# EAGLE design controller3 (EAGLE 7.6.0)
CNAME: timebox controller; CREVISION: 1.0; DESIGNER: volzo
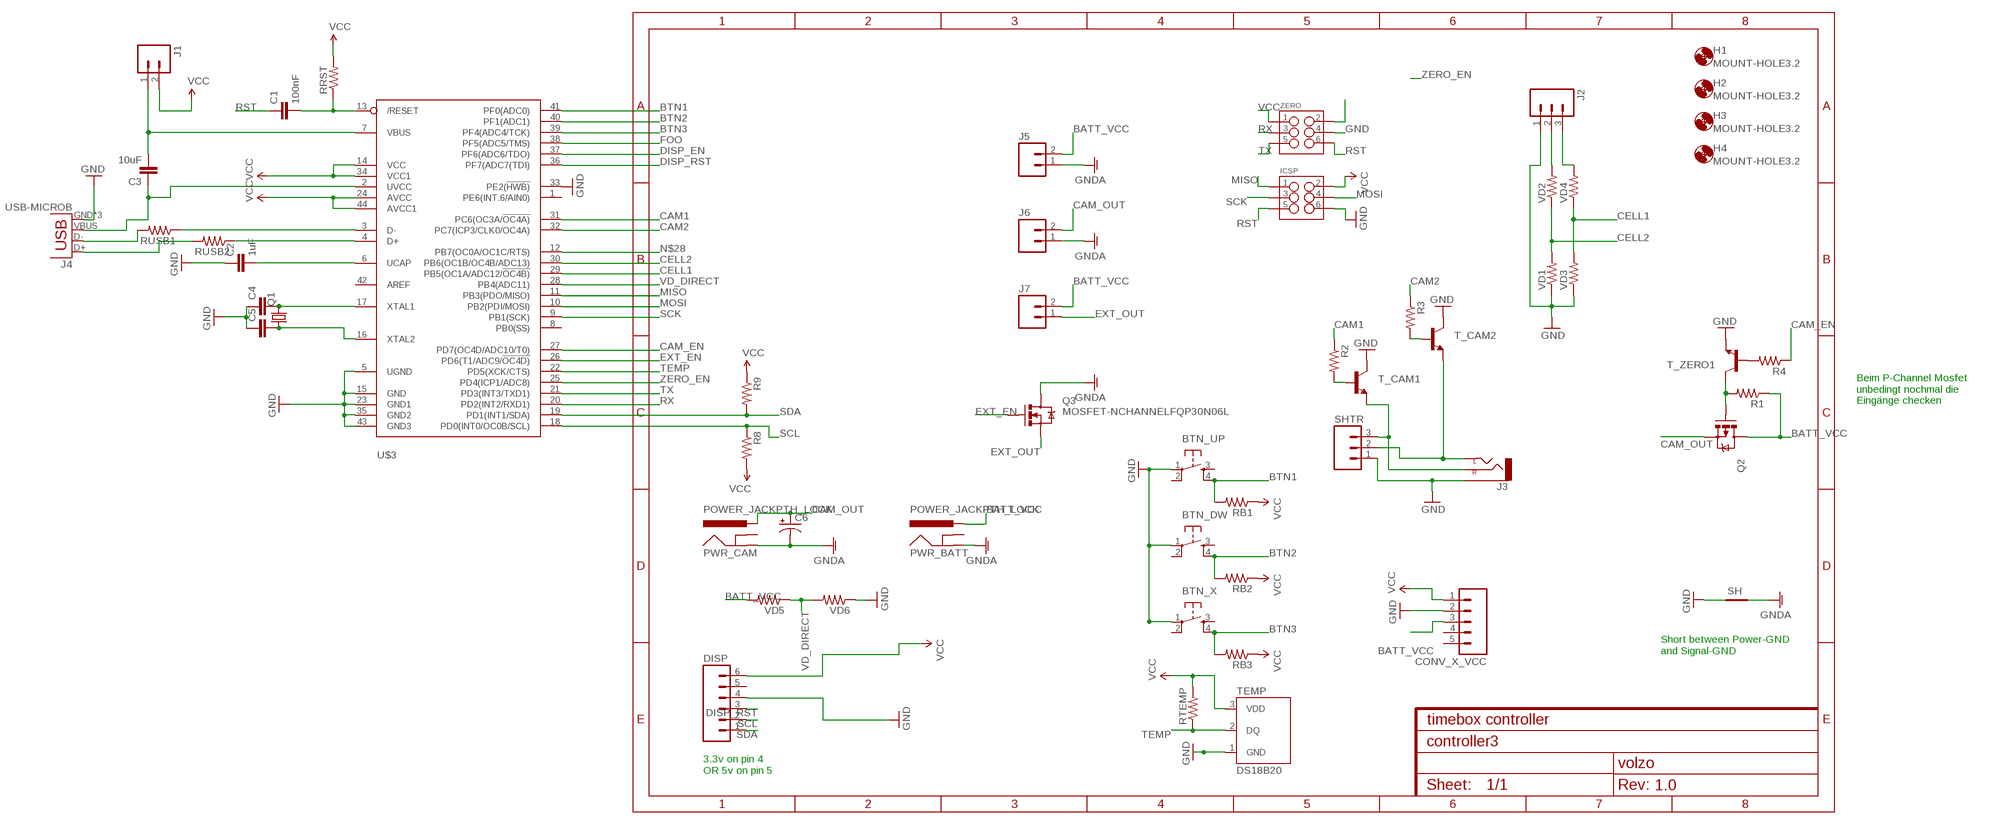
[diagram p0: schematic, sheet 1]

## Parts
BTN_DW  TAC_SWITCHPTH  [TACTILE-PTH]
BTN_UP  TAC_SWITCHPTH  [TACTILE-PTH]
BTN_X  TAC_SWITCHPTH  [TACTILE-PTH]
C1  100nF  CAP1206  [1206]
C2  1uF  CAP1206  [1206]
C3  10uF  CAP1206  [1206]
C4  CAP1206  [1206]
C5  CAP1206  [1206]
C6  CAP_POLPTH3  [CPOL-RADIAL-1000UF-63V]
CONV_X_VCC  M05LOCK  [1X05_LOCK]
DISP  M06FEMALE_LOCK  [1X06_FEMALE_LOCK.010]
H1  MOUNT-HOLE3.2  [3,2]
H2  MOUNT-HOLE3.2  [3,2]
H3  MOUNT-HOLE3.2  [3,2]
H4  MOUNT-HOLE3.2  [3,2]
ICSP  M03X2FEMALE  [2X3]
J1  M02LOCK  [1X02_LOCK]
J2  M03LOCK  [1X03_LOCK]
J3  AUDIO-JACK2.5MM  [STEREOJACK2.5MM_STEREOJACK2.5MM]
J4  USB-MICROB  [USB-MICROB]
J5  M025MM  [SCREWTERMINAL-5MM-2]
J6  M025MM  [SCREWTERMINAL-5MM-2]
J7  M025MM  [SCREWTERMINAL-5MM-2]
PWR_BATT  POWER_JACKPTH_LOCK  [POWER_JACK_PTH_LOCK]
PWR_CAM  POWER_JACKPTH_LOCK  [POWER_JACK_PTH_LOCK]
Q1  CRYSTALHC49S  [HC49/S]
Q2  MOSFET-PCHANNELFQP27P06  [TO220V]
Q3  MOSFET-NCHANNELFQP30N06L  [TO220V]
R1  RESISTOR1206  [1206]
R2  RESISTOR1206  [1206]
R3  RESISTOR1206  [1206]
R4  RESISTOR1206  [1206]
R8  RESISTOR1206  [1206]
R9  RESISTOR1206  [1206]
RB1  RESISTOR1206  [1206]
RB2  RESISTOR1206  [1206]
RB3  RESISTOR1206  [1206]
RRST  RESISTOR1206  [1206]
RTEMP  RESISTOR1206  [1206]
RUSB1  RESISTOR1206  [1206]
RUSB2  RESISTOR1206  [1206]
SH  SHORT-HT5  [SHORT_TOP-50]
SHTR  M03LOCK  [1X03_LOCK]
T_CAM1  TRANSISTOR_NPN2N3904  [TO-92]
T_CAM2  TRANSISTOR_NPN2N3904  [TO-92]
T_ZERO1  TRANSISTOR_NPN2N3904  [TO-92]
TEMP  DS18B20  [TO-92-AMMO]
U$3  ATMEGA32U4-AU  [TQFP44]
VD1  RESISTOR1206  [1206]
VD2  RESISTOR1206  [1206]
VD3  RESISTOR1206  [1206]
VD4  RESISTOR1206  [1206]
VD5  RESISTOR1206  [1206]
VD6  RESISTOR1206  [1206]
ZERO  M03X2FEMALE  [2X3]

## Nets
BATT_VCC [power]: CONV_X_VCC.3 J5.2 J7.2 PWR_BATT.PWR Q2.2(D) R1.1 VD5.2
BTN1: BTN_UP.4 RB1.2 U$3.41(PF0(ADC0))
BTN2: BTN_DW.4 RB2.2 U$3.40(PF1(ADC1))
BTN3: BTN_X.4 RB3.2 U$3.39(PF4(ADC4/TCK))
CAM1: R2.1 U$3.31(PC6(OC3A/!OC4A))
CAM2: R3.1 U$3.32(PC7(ICP3/CLK0/OC4A))
CAM_EN: R4.1 U$3.27(PD7(OC4D/ADC10/T0))
CAM_OUT [power]: C6.1(+) J6.2 PWR_CAM.PWR Q2.3(S)
CELL1: U$3.29(PB5(OC1A/ADC12/!OC4B)) VD3.2 VD4.1
CELL2: U$3.30(PB6(OC1B/OC4B/ADC13)) VD1.2 VD2.1
DISP_EN: U$3.37(PF6(ADC6/TDO))
DISP_RST: DISP.3 U$3.36(PF7(ADC7(TDI))
EXT_EN: Q3.1(G) U$3.26(PD6(T1/ADC9/!OC4D))
EXT_OUT: J7.1 Q3.3(S)
FOO: U$3.38(PF5(ADC5/TMS))
GND: BTN_DW.1 BTN_UP.1 BTN_X.1 C2.1 C4.1 C5.1 CONV_X_VCC.2 DISP.4 ICSP.6 J2.1 J3.SHIELD(SLEEVE) J4.GND J4.MT1(GND) J4.MT2(GND) SH.1 SHTR.1 T_CAM1.3(C) T_CAM2.3(C) T_ZERO1.1(E) TEMP.1(GND) U$3.5(UGND) U$3.15(GND) U$3.23(GND1) U$3.33(PE2(!HWB)) U$3.35(GND2) U$3.43(GND3) VD1.1 VD3.1 VD6.1 ZERO.4
GNDA [power]: C6.2(-) J5.1 J6.1 PWR_BATT.GND PWR_CAM.GND Q3.2(D) SH.2
MISO: ICSP.1 U$3.11(PB3(PDO/MISO))
MOSI: ICSP.4 U$3.10(PB2(PDI/MOSI))
N$1: C1.2 RRST.1 U$3.13(/RESET)
N$2: J2.3 VD4.2
N$3: J2.2 VD2.2
N$4: RUSB1.1 U$3.3(D-)
N$5: RUSB2.1 U$3.4(D+)
N$6: C3.1 J4.VBUS U$3.2(UVCC)
N$7: R4.2 T_ZERO1.2(B)
N$8: C4.2 Q1.2 U$3.17(XTAL1)
N$9: C5.2 Q1.1 U$3.16(XTAL2)
N$10: ZERO.2
N$11: C3.2 J1.1 U$3.7(VBUS)
N$12: J4.D- RUSB1.2
N$13: J4.D+ RUSB2.2
N$16: J3.RING(RIGHT) SHTR.3 T_CAM1.1(E)
N$17: J3.TIP(LEFT) SHTR.2 T_CAM2.1(E)
N$18: R2.2 T_CAM1.2(B)
N$19: R3.2 T_CAM2.2(B)
N$20: C2.2 U$3.6(UCAP)
N$21: Q2.1(G) R1.2 T_ZERO1.3(C)
N$28: U$3.12(PB7(OC0A/OC1C/RTS))
RST: C1.1 ICSP.5 ZERO.6
RX: U$3.20(PD2(INT2/RXD1)) ZERO.3
SCK: ICSP.3 U$3.9(PB1(SCK))
SCL: DISP.2 R8.1 U$3.18(PD0(INT0/OC0B/SCL))
SDA: DISP.1 R9.2 U$3.19(PD1(INT1/SDA))
TEMP: RTEMP.1 TEMP.2(DQ) U$3.22(PD5(XCK/CTS))
TX: U$3.21(PD3(INT3/TXD1)) ZERO.5
VCC: CONV_X_VCC.1 DISP.6 ICSP.2 J1.2 R8.2 R9.1 RB1.1 RB2.1 RB3.1 RRST.2 RTEMP.2 TEMP.3(VDD) U$3.14(VCC) U$3.24(AVCC) U$3.34(VCC1) U$3.44(AVCC1) ZERO.1
VD_DIRECT: U$3.28(PB4(ADC11)) VD5.1 VD6.2
ZERO_EN: U$3.25(PD4(ICP1/ADC8))
Unconnected: BTN_DW.2 BTN_DW.3 BTN_UP.2 BTN_UP.3 BTN_X.2 BTN_X.3 CONV_X_VCC.4 CONV_X_VCC.5 DISP.5 PWR_BATT.GNDBREAK PWR_CAM.GNDBREAK U$3.1(PE6(INT.6/AIN0)) U$3.8(PB0(SS)) U$3.42(AREF)

## Notes on the sheet
- Beim P-Channel Mosfet
  unbedingt nochmal die 
  Eingänge checken
- Short between Power-GND
  and Signal-GND
- 3.3v on pin 4
  OR 5v on pin 5

## Library data of the parts
BTN_DW BTN_UP BTN_X = SparkFun-Retired:TAC_SWITCH: Momentary Switch Button commonly used for reset or general input. Spark Fun Electronics SKU : COM-00097 SMT- SWCH-08247
C1 C3-C5 = SparkFun-Passives:CAP: Capacitor Standard 0603 ceramic capacitor, and 0.1" leaded capacitor.
C2 = SparkFun-Capacitors:CAP: Capacitor Standard 0603 ceramic capacitor, and 0.1" leaded capacitor.
C6 = SparkFun-Capacitors:CAP_POL: Capacitor Polarized These are standard SMD and PTH capacitors. Normally 10uF, 47uF, and 100uF in electrolytic and tantalum varieties. Always verify the external diameter of the through hole cap, it varies with capacity, voltage, and manufacturer. The EIA devices should be standard.
CONV_X_VCC = SparkFun-Connectors:M05: Header 5 Standard 5-pin 0.1" header. Use with straight break away headers (SKU : PRT-00116), right angle break away headers (PRT-00553), swiss pins (PRT-00743), machine pins (PRT-00117), and female headers (PRT-00115). Molex polarized connector foot print use with SKU : PRT-08230 with associated crimp pins and housings.
DISP = SparkFun-Connectors:M06: Header 6 Standard 6-pin 0.1" header. Use with straight break away headers (SKU : PRT-00116), right angle break away headers (PRT-00553), swiss pins (PRT-00743), machine pins (PRT-00117), and female headers (PRT-00115). Molex polarized connector foot print use with SKU : PRT-08094 with associated crimp pins and housings. NOTES ON THE VARIANTS LOCK and LOCK_LONGPADS... This footprint was designed to help hold the alignment of a through-hole component (i.e. 6-pin header) while soldering it into place. You may notice that each hole has been shifted either up or down by 0.005 of an inch from it's more standard position (which is a perfectly straight line). This slight alteration caused the pins (the squares in the middle) to touch the edges of the holes. Because they are alternating, it causes a "brace" to hold the component in place. 0.005 has proven to be the perfect amount of "off-center" position when using our standard breakaway headers. Although looks a little odd when you look at the bare footprint, once you have a header in there, the alteration is very hard to notice. Also,if you push a header all the way into place, it is covered up entirely on the bottom side. This idea of altering the position of holes to aid alignment will be further integrated into the Sparkfun Library for other footprints. It can help hold any component with 3 or more connection pins.
H1-H4 = holes:MOUNT-HOLE: MOUNTING HOLE with drill center marker
ICSP ZERO = SparkFun-Connectors:M03X2: 2x3 .1" header. Shrouded, with keying- CONN-10681 SMT- CONN-11415 Pogo pins- HW-11044; PROD_ID: CONN-11566; VALUE: FEMALE 2x3
J1 = SparkFun-Connectors:M02: Standard 2-pin 0.1" header. Use with - straight break away headers ( PRT-00116) - right angle break away headers (PRT-00553) - swiss pins (PRT-00743) - machine pins (PRT-00117) - female headers (PRT-00115) Molex polarized connector foot print use with: PRT-08233 with associated crimp pins and housings. 2.54_SCREWTERM for use with PRT-10571. 3.5mm Screw Terminal footprints for PRT-08084 5mm Screw Terminal footprints for use with PRT-08432
J2 SHTR = SparkFun-Connectors:M03: Header 3 Standard 3-pin 0.1" header. Use with straight break away headers (SKU : PRT-00116), right angle break away headers (PRT-00553), swiss pins (PRT-00743), machine pins (PRT-00117), and female headers (PRT-00115). Molex polarized connector foot print use with SKU : PRT-08232 with associated crimp pins and housings.
J3 = SparkFun-Connectors:AUDIO-JACK: 3.5mm Audio Jack Simple 3.5mm common PCB mount audio jack. Variant PTH is our storefront SKU PRT-08032
J4 = SparkFun-Connectors:USB: USB Connectors USB-B-PTH is fully proven SKU : PRT-00139/CONN-08278 USB-miniB is fully proven SKU : PRT-00587 USB-A-PCB is untested. USB-A-H is throughly reviewed, but untested. Spark Fun Electronics SKU : PRT-00437 USB-B-SMT is throughly reviewed, but untested. Needs silkscreen touching up. USB-A-S has not been used/tested USB-MB-H has not been used/tested USB-MICROB has been used. CONN-09505; PROD_ID: CONN-09505
J5-J7 = SparkFun-Connectors:M02: Standard 2-pin 0.1" header. Use with - straight break away headers ( PRT-00116) - right angle break away headers (PRT-00553) - swiss pins (PRT-00743) - machine pins (PRT-00117) - female headers (PRT-00115) Molex polarized connector foot print use with: PRT-08233 with associated crimp pins and housings. 2.54_SCREWTERM for use with PRT-10571. 3.5mm Screw Terminal footprints for PRT-08084 5mm Screw Terminal footprints for use with PRT-08432; STOREFRONT_ID: PRT-08432
PWR_BATT PWR_CAM = SparkFun-Connectors:POWER_JACK: Power Jack This is the standard 5.5mm barrel jack for power. The PTH is the most common, proven, reliable, footprint. The Slot footprint only works if the mill layer is transmitted to the PCB fab house so be warned. Mating wall wart : TOL-00298 (and others); PROD_ID: CONN-08197; SF_ID: PRT-00119
Q1 = adafruit:CRYSTAL: CRYSTAL; OC_FARNELL: 1667008; OC_NEWARK: unknown
Q2 = SparkFun-DiscreteSemi:MOSFET-PCHANNEL: Generic PMOSFET IRLML2244 - TRANS-11153 (SOT-23 -20V -4.3A) (1.Gate 2.Source 3.Drain) FQP27P06 - COM-10349 <http://www.sparkfun.com/products/10349> (TO-220 -60V -27A) (1.Gate 2.Source 3.Drain)
Q3 = SparkFun-DiscreteSemi:MOSFET-NCHANNEL: Common NMOSFET Parts MFG P/N Store ID Prod ID FDD8780 TRANS-09984 SI7820DN TRANS-11055 FDS6630A IC-08089 2N7002PW TRANS-11151 FQP30N06L COM-10213 TRANS-10060 BSS123LT1G TRANS-08345 BSS138 TRANS-00830 BS170 2N7000; PROD_ID: TRANS-10060
R1-R4 R8 R9 RB1-RB3 RRST RTEMP RUSB1 RUSB2 VD1-VD6 = SparkFun-Passives:RESISTOR: Resistor Basic schematic elements and footprints for 0603, 1206, and PTH resistors.
SH = shorts-old:SHORT-H: Short between two nets; BOM: no
T_CAM1 T_CAM2 T_ZERO1 = SparkFun-DiscreteSemi:TRANSISTOR_NPN: Generic NPN BJT MMBT2222A - TRANS-08049 (SOT-23, 1A 40V) MPSA42 - TRANS-09116 (SOT-23, 500mA 300V) MMBT5088LT1G - TRANS-11160 (SOT-23, 50 mA 30V) BC547 - COM-08928 <http://www.sparkfun.com/products/8928> (TO-92 45V 100mA) (1.Collector 2.Base 3.Emitter) 2N3904 - COM-00521 <http://www.sparkfun.com/products/521> (TO-92 40V 200mA) (1.Emitter 2.Base 3.Collector) P2N2222A - COM-12852 <http://www.sparkfun.com/products/12852> (TO-92 40V 600mA) (1.Collector 2.Base 3.Emitter); PROD_ID: TRANS-08447
TEMP = SparkFun-Sensors:DS18B20: Dallas/Maxim DS18B20 1-wire temperature sensor Datasheet: http://datasheets.maximintegrated.com/en/ds/DS18B20.pdf temp thermometer 1-wire one-wire one wire; STORE_ID: SEN-00245
U$3 = adafruit:ATMEGA32U4: http://www.ladyada.net/library/eagle

## Net classes
0 default: width 0.508 mm
1 power: width 0.762 mm, clearance 0.254 mm

## Board
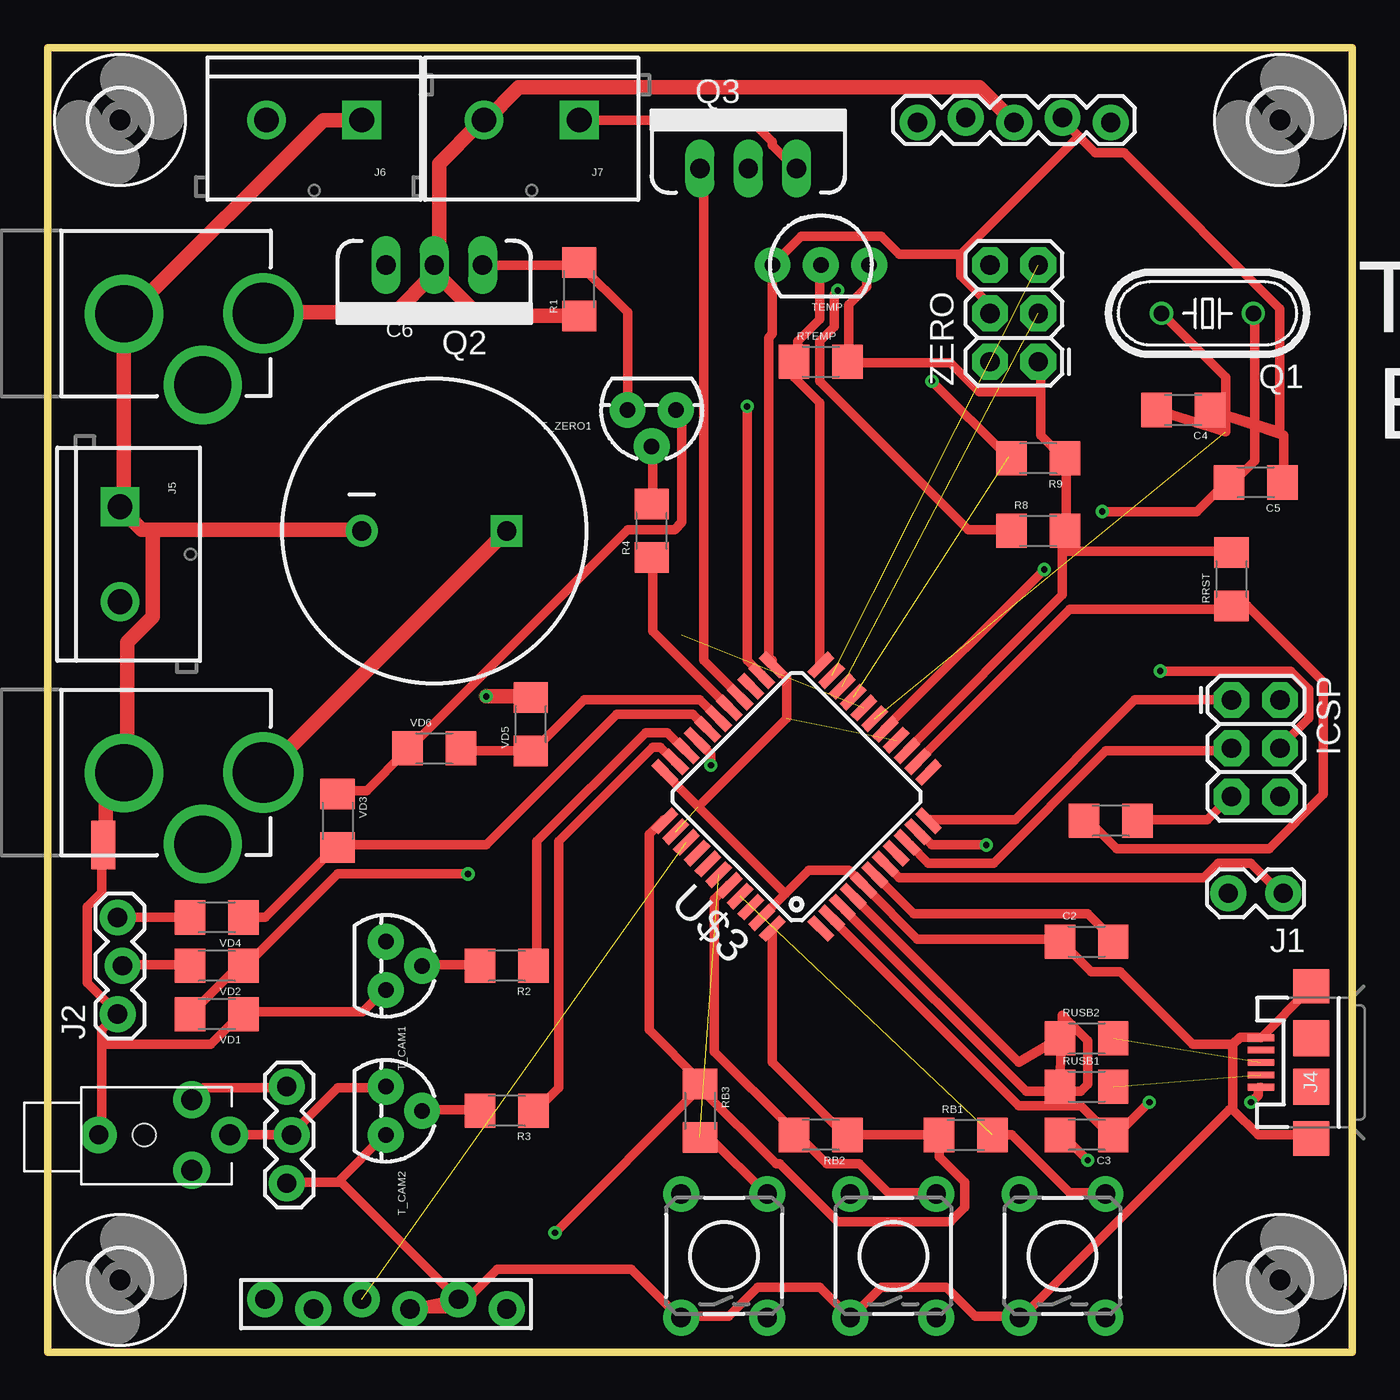
[diagram p1: board, top side]
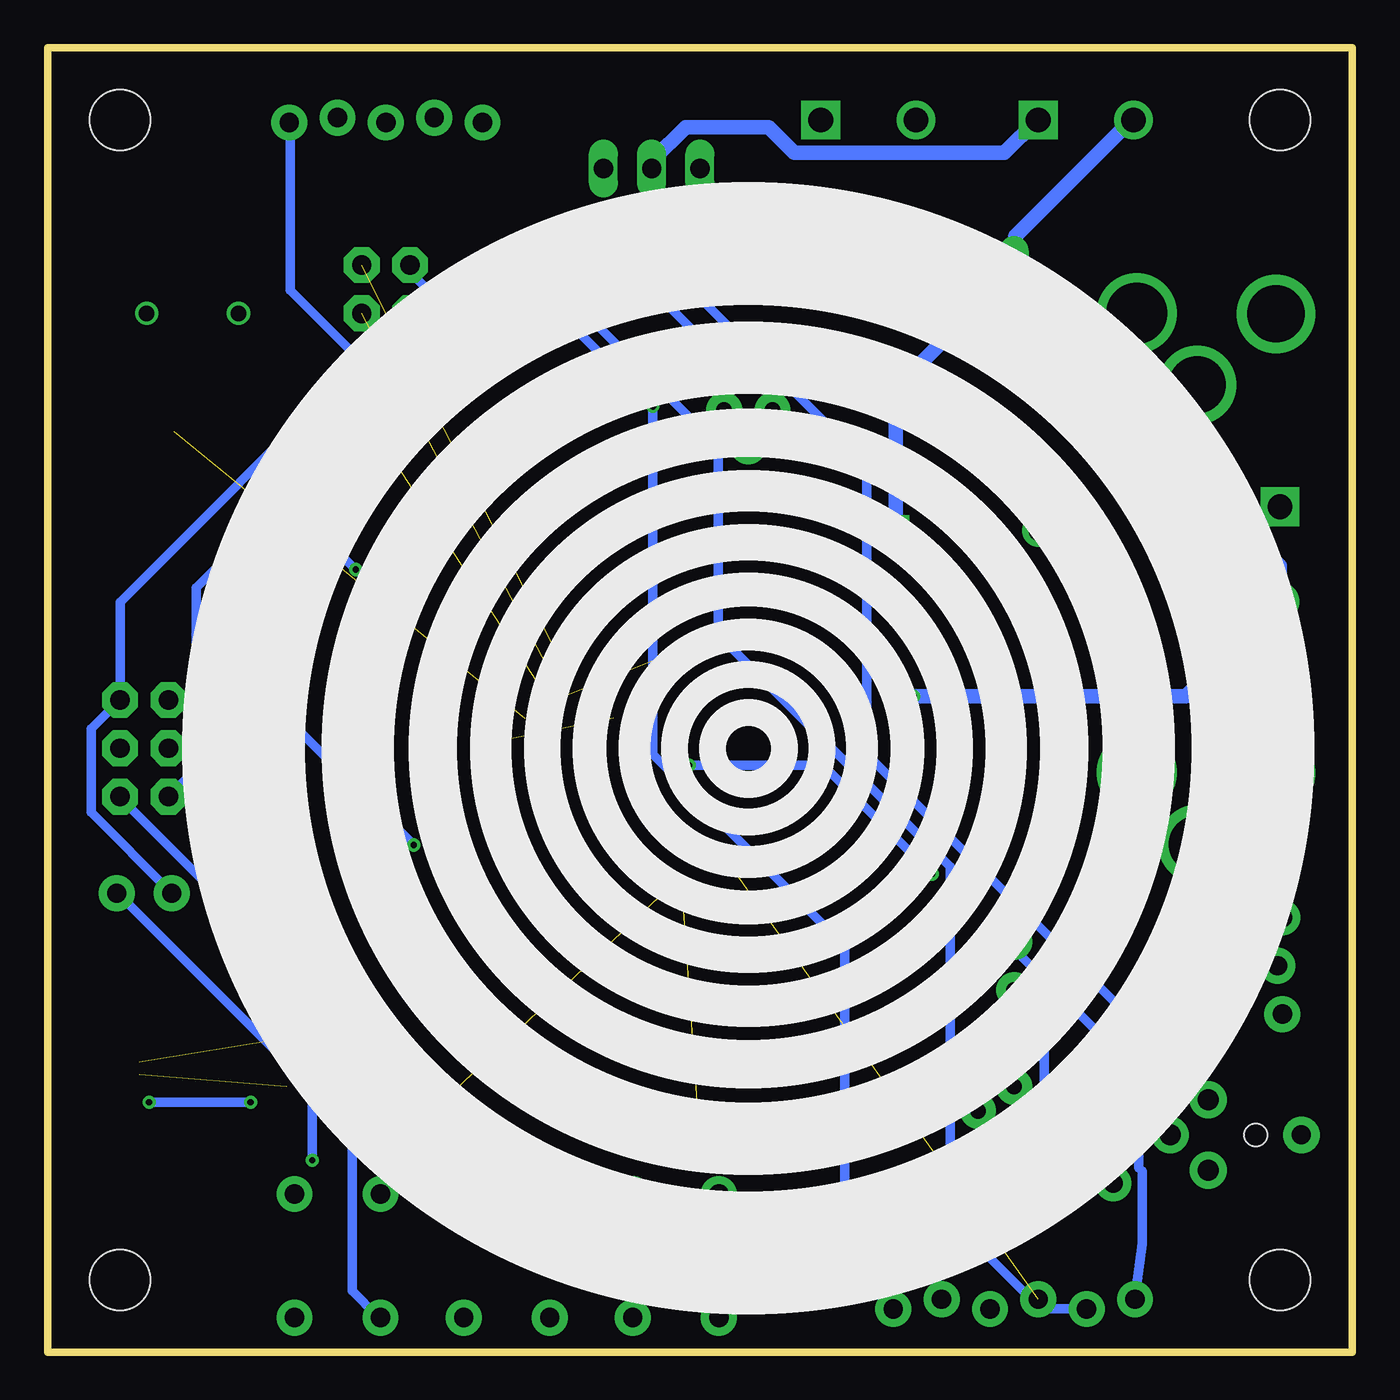
[diagram p2: board, bottom side, seen from below]

Size 68.58 x 68.58 mm. Coordinates in mm from the lower left corner, seen from the top.
Outline: 0,0 68.58,0 68.58,68.58 0,68.58 0,0
Copper layers (1*16): Top 0.0356mm / dielectric 1.5011mm / Bottom 0.0356mm
Design rules "oshpark-2layer *": minimum track width 6mil, minimum drill 13mil, track to track 10mil, track to pad 10mil, pad to pad 10mil, via to via 10mil, smd to smd 10mil, copper to edge 15mil, drill to drill 6mil, minimum pad ring 7mil, minimum via ring 7mil, stop-mask expansion 2.5mil, vias tented up to drill 0mil, thermal gap 10mil

### Footprints (pad centres in the part's own frame; a part is rotated, then mirrored left to right if it is on the bottom)
TACTILE-PTH = drill 1.016 pad 1.88: 1 -3.251,2.261; 2 3.251,2.261; 3 -3.251,-2.261; 4 3.251,-2.261
1206 = smd 1.6 x 1.8: 1 -1.4,0; 2 1.4,0
CPOL-RADIAL-1000UF-63V = drill 1.016 pad 1.651 square: 1 3.81,0 | drill 1.016 pad 1.676: 2 -3.81,0
1X05_LOCK = drill 1.016 pad 1.88: 1 0,0.127; 2 2.54,-0.127; 3 5.08,0.127; 4 7.62,-0.127; 5 10.16,0.127
1X06_FEMALE_LOCK.010 = drill 1.016 pad 1.88: 1 0,0.254; 2 2.54,-0.254; 3 5.08,0.254; 4 7.62,-0.254; 5 10.16,0.254; 6 12.7,-0.254
3,2 = hole 3.2: 0,0
2X3 = drill 1.016 pad 1.88 octagon: 1 0,0; 2 0,2.54; 3 2.54,0; 4 2.54,2.54; 5 5.08,0; 6 5.08,2.54
1X02_LOCK = drill 1.016 pad 1.88: 1 -0.178,0; 2 2.718,0
1X03_LOCK = drill 1.016 pad 1.88: 1 0,0.127; 2 2.54,-0.127; 3 5.08,0.127
STEREOJACK2.5MM_STEREOJACK2.5MM = drill 1.1 pad 1.93: RING 2.5,1.85; RING2 2.5,-1.85; TIP 4.5,0 | drill 1 pad 1.93: SHIELD -2.4,0 | hole 1.2: 0,0
USB-MICROB = smd 0.35 x 1.4: D+ 0,2.65; D- -0.65,2.65; GND 1.3,2.65; ID 0.65,2.65; VBUS -1.3,2.65 | smd 1.8 x 1.9: MT1 -4,0; MT2 4,0 | smd 1.9 x 1.9: P$1 -1.27,0; P$2 1.27,0
SCREWTERMINAL-5MM-2 = drill 1.3 pad 2.032 square: 1 0,0 | drill 1.3 pad 2.032: 2 5,0
POWER_JACK_PTH_LOCK = drill 2.997 pad 4.115: GND 0.025,6.557; GNDBREAK 3.762,10.7 | drill 3.2 pad 4.115: PWR 0,13.878
HC49/S = drill 0.813: 1 -2.413,0; 2 2.413,0
TO220V = drill 1.016 long: 1 -2.54,0; 2 0,0; 3 2.54,0
SHORT_TOP-50 = smd 1.27 x 1.27: 1 0.635,0; 2 -0.635,0
TO-92 = drill 0.813 pad 1.88: 1 -1.27,0; 2 0,1.905; 3 1.27,0
TO-92-AMMO = drill 0.813 pad 1.88: 1 -2.54,0; 2 0,0; 3 2.54,0
TQFP44 = smd 1.5 x 0.5: 1 -5.8,4; 2 -5.8,3.2; 3 -5.8,2.4; 4 -5.8,1.6; 5 -5.8,0.8; 6 -5.8,0; 7 -5.8,-0.8; 8 -5.8,-1.6; 9 -5.8,-2.4; 10 -5.8,-3.2; 11 -5.8,-4; 23 5.8,-4; 24 5.8,-3.2; 25 5.8,-2.4; 26 5.8,-1.6; 27 5.8,-0.8; 28 5.8,0; 29 5.8,0.8; 30 5.8,1.6; 31 5.8,2.4; 32 5.8,3.2; 33 5.8,4 | smd 0.5 x 1.5: 12 -4,-5.8; 13 -3.2,-5.8; 14 -2.4,-5.8; 15 -1.6,-5.8; 16 -0.8,-5.8; 17 0,-5.8; 18 0.8,-5.8; 19 1.6,-5.8; 20 2.4,-5.8; 21 3.2,-5.8; 22 4,-5.8; 34 4,5.8; 35 3.2,5.8; 36 2.4,5.8; 37 1.6,5.8; 38 0.8,5.8; 39 0,5.8; 40 -0.8,5.8; 41 -1.6,5.8; 42 -2.4,5.8; 43 -3.2,5.8; 44 -4,5.8

### Placement (x,y rotation side)
BTN_DW  44.45,5.08 90 top
BTN_UP  53.34,5.08 90 top
BTN_X  35.56,5.08 90 top
C1  55.88,27.94 180 top
C2  54.61,21.59 0 top
C3  54.61,11.43 180 top
C4  59.69,49.53 180 top
C5  63.5,45.72 180 top
C6  20.32,43.18 0 top
CONV_X_VCC  55.88,64.77 180 top
DISP  11.43,2.54 0 top
H1  3.81,64.77 0 top
H2  64.77,3.81 0 top
H3  64.77,64.77 0 top
H4  3.81,3.81 0 top
ICSP  62.23,34.29 270 top
J1  64.77,24.13 180 top
J2  3.81,17.78 90 top
J3  5.08,11.43 0 top
J4  66.42,15.24 90 top
J5  3.81,44.45 270 top
J6  16.51,64.77 180 top
J7  27.94,64.77 180 top
PWR_BATT  -2.54,54.61 270 top
PWR_CAM  -2.54,30.48 270 top
Q1  60.96,54.61 180 top
Q2  20.32,57.15 180 top
Q3  36.83,62.23 0 top
R1  27.94,55.88 90 top
R2  24.13,20.32 180 top
R3  24.13,12.7 180 top
R4  31.75,43.18 90 top
R8  52.07,43.18 0 top
R9  52.07,46.99 180 top
RB1  48.26,11.43 0 top
RB2  40.64,11.43 180 top
RB3  34.29,12.7 270 top
RRST  62.23,40.64 90 top
RTEMP  40.64,52.07 0 top
RUSB1  54.61,13.97 0 top
RUSB2  54.61,16.51 0 top
SH  2.92,26.67 270 top
SHTR  12.7,8.89 90 top
T_CAM1  17.78,20.32 270 top
T_CAM2  17.78,12.7 270 top
T_ZERO1  31.75,49.53 180 top
TEMP  40.64,57.15 0 top
U$3  39.37,29.21 135 top
VD1  8.89,17.78 180 top
VD2  8.89,20.32 180 top
VD3  15.24,27.94 270 top
VD4  8.89,22.86 180 top
VD5  25.4,33.02 90 top
VD6  20.32,31.75 0 top
ZERO  52.07,52.07 90 top

### Tracks (layer width: path | path; a pad name or v marks a point on that pad's centre or on a via)
BATT_VCC  (via drill 0.33)
  Top 0.762: v23.05,34.48 25.34,34.48 VD5.2 | R1.1 27.81,54.48 22.67,54.48 20.38,56.77 20.38,57.15 Q2.2 | CONV_X_VCC.3 48.96,66.48 24.77,66.48 23.05,64.77 J7.2 22.67,64.58 20.57,62.48 20.57,57.34 Q2.2 | PWR_BATT.PWR 11.43,54.67 18.29,54.67 20.19,56.58 Q2.2
  Bottom 0.762: v23.05,34.48 8.76,34.48 3.81,39.43 J5.2 3.81,41.34 11.24,48.77 11.24,54.48 PWR_BATT.PWR
BTN1  (1 unrouted)
  Top 0.508: RB1.2 50.67,11.43 53.72,8.38 55.44,8.38 BTN_UP.4
BTN2
  Top 0.508: U$3.40 35.81,24.57 35.05,23.81 35.05,15.81 39.05,11.81 39.05,11.43 RB2.2 39.43,11.43 40.96,9.91 42.67,9.91 44.2,8.38 46.67,8.38 BTN_DW.4
BTN3  (1 unrouted)
  Top 0.508: RB3.2 34.29,11.24 34.86,11.24 37.72,8.38 BTN_X.4
CAM1
  Top 0.508: U$3.31 33.53,31.62 32.58,32.58 31.43,32.58 25.72,26.86 25.72,20.38 R2.1
CAM2
  Top 0.508: U$3.32 32.96,31.05 32.19,31.81 31.81,31.81 26.86,26.86 26.86,13.91 25.72,12.76 R3.1
CAM_EN
  Top 0.508: U$3.27 35.81,33.91 31.81,37.91 31.81,41.72 R4.1
CAM_OUT
  Top 0.762: C6.1 11.43,30.48 PWR_CAM.PWR
  Bottom 0.762: J6.2 11.62,64.77 17.72,58.67 17.72,57.15 Q2.3 17.72,56.96 24,50.67 24,43.24 C6.1
CELL1
  Top 0.508: U$3.29 34.67,32.77 33.91,33.53 29.91,33.53 23.05,26.67 15.24,26.67 VD3.2 15.05,26.48 11.43,22.86 VD4.1
CELL2  (via drill 0.33)
  Top 0.508: v34.86,30.86 34.86,31.43 34.29,32 U$3.30 | v22.1,25.15 15.24,25.15 10.48,20.38 VD2.1 10.1,20.38 7.62,17.91 VD1.2
  Bottom 0.508: v34.86,30.86 27.81,30.86 v22.1,25.15
DISP_RST  (1 unrouted)
EXT_EN
  Top 0.508: U$3.26 36.39,34.48 34.48,36.39 34.48,61.91 34.29,62.1 Q3.1
EXT_OUT
  Top 0.508: J7.1 36.96,64.77 38.1,63.63 38.1,63.44 39.24,62.29 Q3.3
GND  (2 unrouted)
  Top 0.508: C5.1 64.96,45.72 64.96,48.2 C4.1 64.77,48.39 64.77,54.86 56.58,63.06 55.05,63.06 54.2,63.91 | 54.2,63.91 53.34,64.77 CONV_X_VCC.2 | ZERO.4 49.53,55.05 48.01,56.58 48.01,57.72 | 54.2,63.91 48.01,57.72 | VD3.1 15.24,29.53 16.76,29.53 18.86,31.62 VD6.1 19.05,31.81 30.48,43.24 32.96,43.24 33.34,43.62 33.34,49.34 33.15,49.53 T_ZERO1.1 | 48.01,57.72 44.77,57.72 43.81,58.67 39.62,58.67 TEMP.1 38.1,53.53 37.91,53.34 37.91,36.58 38.1,36.39 U$3.23 38.1,36.2 38.86,35.43 38.86,33.34 34.2,28.67 | J4.MT2 66.29,19.05 63.82,16.57 J4.GND 63.63,16.57 62.67,16.57 62.29,16.19 | 62.29,12.76 63.63,11.43 66.29,11.43 J4.MT1 | 62.29,16.19 62.29,12.76 | 38.77,24.1 40.01,25.34 42.1,25.34 42.86,24.57 U$3.5 43.05,24.38 45.72,21.72 53.15,21.72 C2.1 53.34,21.53 54.86,20 56.39,20 60.2,16.19 62.29,16.19 | 38.77,24.1 U$3.43 | 38.77,24.1 34.2,28.67 | 34.2,28.67 32.38,30.48 U$3.33 | 15.24,8.95 12.57,8.95 SHTR.1 | 15.24,8.95 17.72,11.43 T_CAM2.3 | 15.24,8.95 15.43,8.95 21.53,2.86 21.53,2.29 DISP.4 21.72,2.86 22.1,2.86 23.62,4.38 30.67,4.38 33.15,1.91 BTN_X.1 33.34,1.91 35.81,1.91 37.34,3.43 40.58,3.43 42.1,1.91 BTN_DW.1 42.29,1.91 43.81,3.43 47.24,3.43 48.77,1.91 51.05,1.91 BTN_UP.1 51.24,1.91 62.1,12.76 62.29,12.76 | T_CAM1.3 17.72,19.05 16.57,17.91 10.48,17.91 VD1.1 10.1,17.72 8.57,16.19 2.86,16.19 | SH.1 2.86,25.91 2.86,24.19 2.1,23.43 2.1,19.43 3.62,17.91 J2.1 2.86,16.95 2.86,16.19 | 2.86,16.19 2.86,11.43 J3.SHIELD
  Bottom 0.508: TEMP.1 33.15,52.2 33.15,49.53 T_ZERO1.1 | T_CAM2.3 17.72,11.43 17.72,11.81 16.19,13.34 16.19,17.53 17.72,19.05 T_CAM1.3 | ICSP.6 64.77,29.15 52.58,16.95 52.58,3.24 51.24,1.91 BTN_UP.1
GNDA
  Top 0.762: SH.2 3.05,27.43 3.05,29.34 4,30.29 PWR_CAM.GND 4.19,30.67 4.19,37.34 5.52,38.67 5.52,43.24 | 5.52,43.24 4.95,43.24 3.81,44.39 J5.1 4,44.77 4,54.48 PWR_BATT.GND 4.38,54.67 14.48,64.77 J6.1 | 5.52,43.24 16.38,43.24 C6.2
  Bottom 0.762: Q3.2 36.77,62.29 36.77,62.67 35.05,64.39 30.67,64.39 29.34,63.06 18.29,63.06 16.57,64.77 J6.1
MISO
  Top 0.508: ICSP.1 57.15,34.29 50.86,28 46.48,28 U$3.11
MOSI  (via drill 0.33)
  Top 0.508: v49.34,26.67 46.48,26.67 45.91,27.24 U$3.10 | v58.48,35.81 65.34,35.81 66.29,34.86 66.29,33.34 64.77,31.81 ICSP.4
  Bottom 0.508: v58.48,35.81 v49.34,26.67
N$1
  Top 0.508: U$3.13 53.72,39.05 62.1,39.05 RRST.1 62.48,39.24 63.06,39.24 67.06,35.24 67.06,29.34 64.2,26.48 56.2,26.48 54.86,27.81 54.48,27.81 C1.2
N$2
  Top 0.508: J2.3 VD4.2
N$3
  Top 0.508: VD2.2 7.43,20.38 4,20.38 J2.2
N$4
  Top 0.508: U$3.3 41.91,23.24 51.44,13.72 54.29,13.72 54.67,14.1 54.67,16.38 53.34,17.72 RUSB1.1
N$5
  Top 0.508: RUSB2.1 51.05,15.24 42.48,23.81 U$3.4
N$6  (via drill 0.33)
  Top 0.508: v63.25,13.14 63.63,13.53 63.63,13.91 J4.VBUS | v57.91,13.14 56.2,11.43 C3.1 55.82,11.43 54.29,12.95 51.05,12.95 41.34,22.67 U$3.2
  Bottom 0.508: v57.91,13.14 v63.25,13.14
N$7
  Top 0.508: R4.2 31.81,44.77 31.81,47.62 T_ZERO1.2
N$8  (1 unrouted)
  Top 0.508: Q1.2 61.91,51.24 61.91,48.39 C4.2
N$9  (via drill 0.33)
  Top 0.508: v52.39,41.15 44.01,32.77 U$3.16 | v55.44,44.2 60.39,44.2 61.91,45.72 C5.2 62.29,45.72 63.44,46.86 63.44,54.48 Q1.1
  Bottom 0.508: v55.44,44.2 v52.39,41.15
N$11  (via drill 0.33)
  Top 0.508: U$3.7 44.2,25.53 44.77,24.96 60.77,24.96 61.53,25.72 63.25,25.72 64.77,24.19 J1.1 | v54.67,10.1 53.34,11.43 C3.2
  Bottom 0.508: v54.67,10.1 54.67,13.91 64.77,24 J1.1
N$12  (1 unrouted)
N$13  (1 unrouted)
N$16
  Top 0.508: SHTR.3 12.57,13.91 8.19,13.91 7.62,13.34 J3.RING
  Bottom 0.508: SHTR.3 12.57,16 17.72,21.14 17.72,21.53 T_CAM1.1
N$17
  Top 0.508: J3.TIP SHTR.2 12.95,11.62 15.24,13.91 17.72,13.91 T_CAM2.1
N$18
  Top 0.508: R2.2 22.67,20.38 19.81,20.38 T_CAM1.2
N$19
  Top 0.508: R3.2 22.67,12.76 19.81,12.76 T_CAM2.2
N$20
  Top 0.508: U$3.6 43.62,24.96 45.53,23.05 54.67,23.05 56.01,21.72 C2.2
N$21
  Top 0.508: Q2.1 27.81,57.15 R1.2 28,57.15 30.48,54.67 T_ZERO1.3
RST
  Top 0.508: C1.1 57.34,28 60.96,28 62.1,29.15 ICSP.5
  Bottom 0.508: ZERO.6 49.53,56.77 48.01,55.24 48.01,51.44 54.29,45.15 55.82,45.15 60.77,40.2 60.77,30.67 ICSP.5
RX  (1 unrouted)
SCK
  Top 0.508: U$3.9 45.34,26.67 46.29,25.72 49.72,25.72 55.63,31.62 62.1,31.62 ICSP.3
SCL  (via drill 0.33)  (1 unrouted)
  Top 0.508: v41.53,55.82 41.34,55.63 41.34,53.91 40.58,53.15 40.58,51.05 48.39,43.24 50.48,43.24 R8.1
  Bottom 0.508: v41.53,55.82 33.34,47.62 33.34,37.72 21.14,25.53 21.14,7.05 16.38,2.29 DISP.2
SDA  (via drill 0.33)  (1 unrouted)
  Top 0.508: v46.48,51.05 50.48,47.05 R9.2
  Bottom 0.508: v46.48,51.05 46.48,56.01 43.81,58.67 37.53,58.67 25.53,46.67 25.53,31.43 11.05,16.95 11.05,12.19 11.24,12 11.24,9.72 11.05,9.53 11.05,5.71 DISP.1
TEMP
  Top 0.508: U$3.22 40.58,36.2 40.58,49.91 39.24,51.24 39.24,52.01 RTEMP.1 39.43,52.2 39.43,53.15 40.58,54.29 40.58,57.15 TEMP.2
TX  (1 unrouted)
VCC  (via drill 0.33)
  Top 0.508: U$3.44 38.1,22.1 38.1,15.24 41.91,11.43 RB2.1 RB1.1 46.86,11.24 46.86,10.29 48.2,8.95 48.2,7.62 47.43,6.86 41.53,6.86 38.48,9.91 38.29,9.91 34.29,13.91 | U$3.34 32.38,28 31.62,27.24 31.62,16.95 34.29,14.29 RB3.1 34.29,13.91 | 34.29,13.91 v26.67,6.29 | v36.77,49.72 36.77,36.39 37.53,35.62 U$3.24 | TEMP.3 43.05,57.15 43.05,56.01 42.1,55.05 42.1,52.2 RTEMP.2 42.29,52.01 47.43,52.01 48.96,50.48 52.2,50.48 | 53.34,42.1 53.34,43.05 R8.2 53.53,43.24 53.53,46.86 R9.1 53.34,47.05 52.2,48.2 52.2,50.48 | 53.34,42.1 53.34,39.81 45.15,31.62 U$3.14 | 53.34,42.1 62.1,42.1 RRST.2 | 52.2,50.48 52.2,52.01 ZERO.1
  Bottom 0.508: DISP.6 v26.67,6.29 26.67,21.34 36.77,31.43 v36.77,49.72 43.05,56.01 43.05,57.15 TEMP.3 | J1.2 62.1,24.19 66.29,28.38 66.29,32.77 ICSP.2 64.77,39.43 52.2,52.01 ZERO.1 55.82,55.82 55.82,64.58 CONV_X_VCC.1
VD_DIRECT
  Top 0.508: U$3.28 35.24,33.34 34.29,34.29 28.19,34.29 25.53,31.62 VD5.1 25.15,31.62 21.91,31.62 VD6.2

### Text on the board
tPlace: TIME | BOX